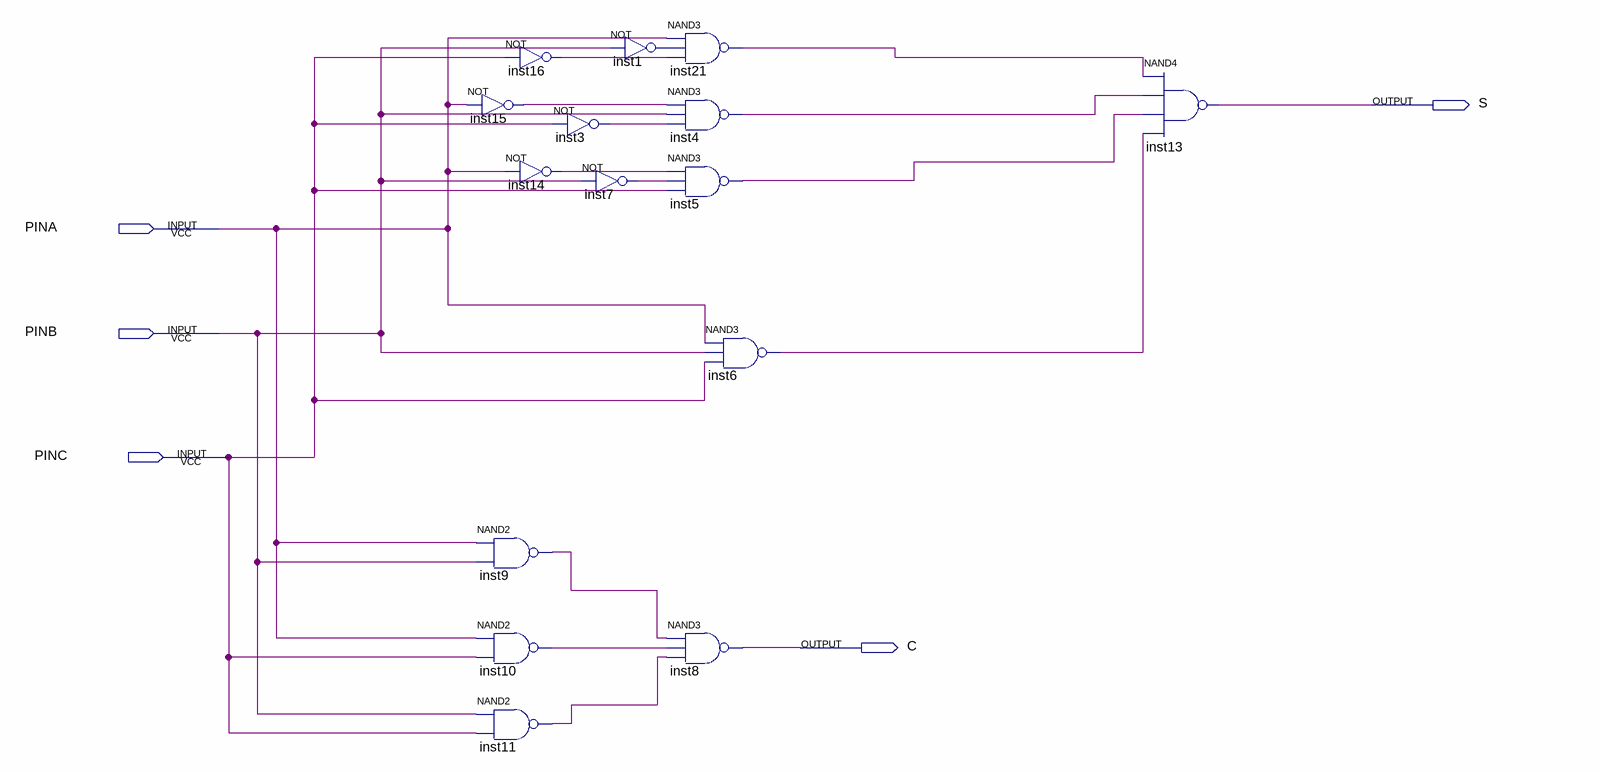
[diagram p0: schematic sheet]
// Quartus schematic full_adder.bdf as structural Verilog: 15 symbols, 5 pins
module full_adder (
  input  PINA,
  input  PINB,
  input  PINC,
  output S,
  output C
);

  wire inst1_out, inst3_out, inst4_out, inst5_out, inst6_out, inst7_out, inst9_out, inst10_out, inst11_out,
       inst14_out, inst15_out, inst16_out, inst21_out;

  not inst16 (inst16_out, PINC);
  not inst15 (inst15_out, PINA);
  not inst14 (inst14_out, PINA);
  nand inst9 (inst9_out, PINA, PINB);
  nand inst10 (inst10_out, PINA, PINC);
  nand inst11 (inst11_out, PINB, PINC);
  not inst3 (inst3_out, PINC);
  not inst7 (inst7_out, PINB);
  nand inst21 (inst21_out, PINA, inst1_out, inst16_out);
  not inst1 (inst1_out, PINB);
  nand inst4 (inst4_out, inst15_out, PINB, inst3_out);
  nand inst5 (inst5_out, inst14_out, inst7_out, PINC);
  nand inst8 (C, inst9_out, inst10_out, inst11_out);
  nand inst6 (inst6_out, PINA, PINB, PINC);
  nand inst13 (S, inst21_out, inst4_out, inst5_out, inst6_out);
endmodule
